# Altium project PCB_Project.PrjPcb
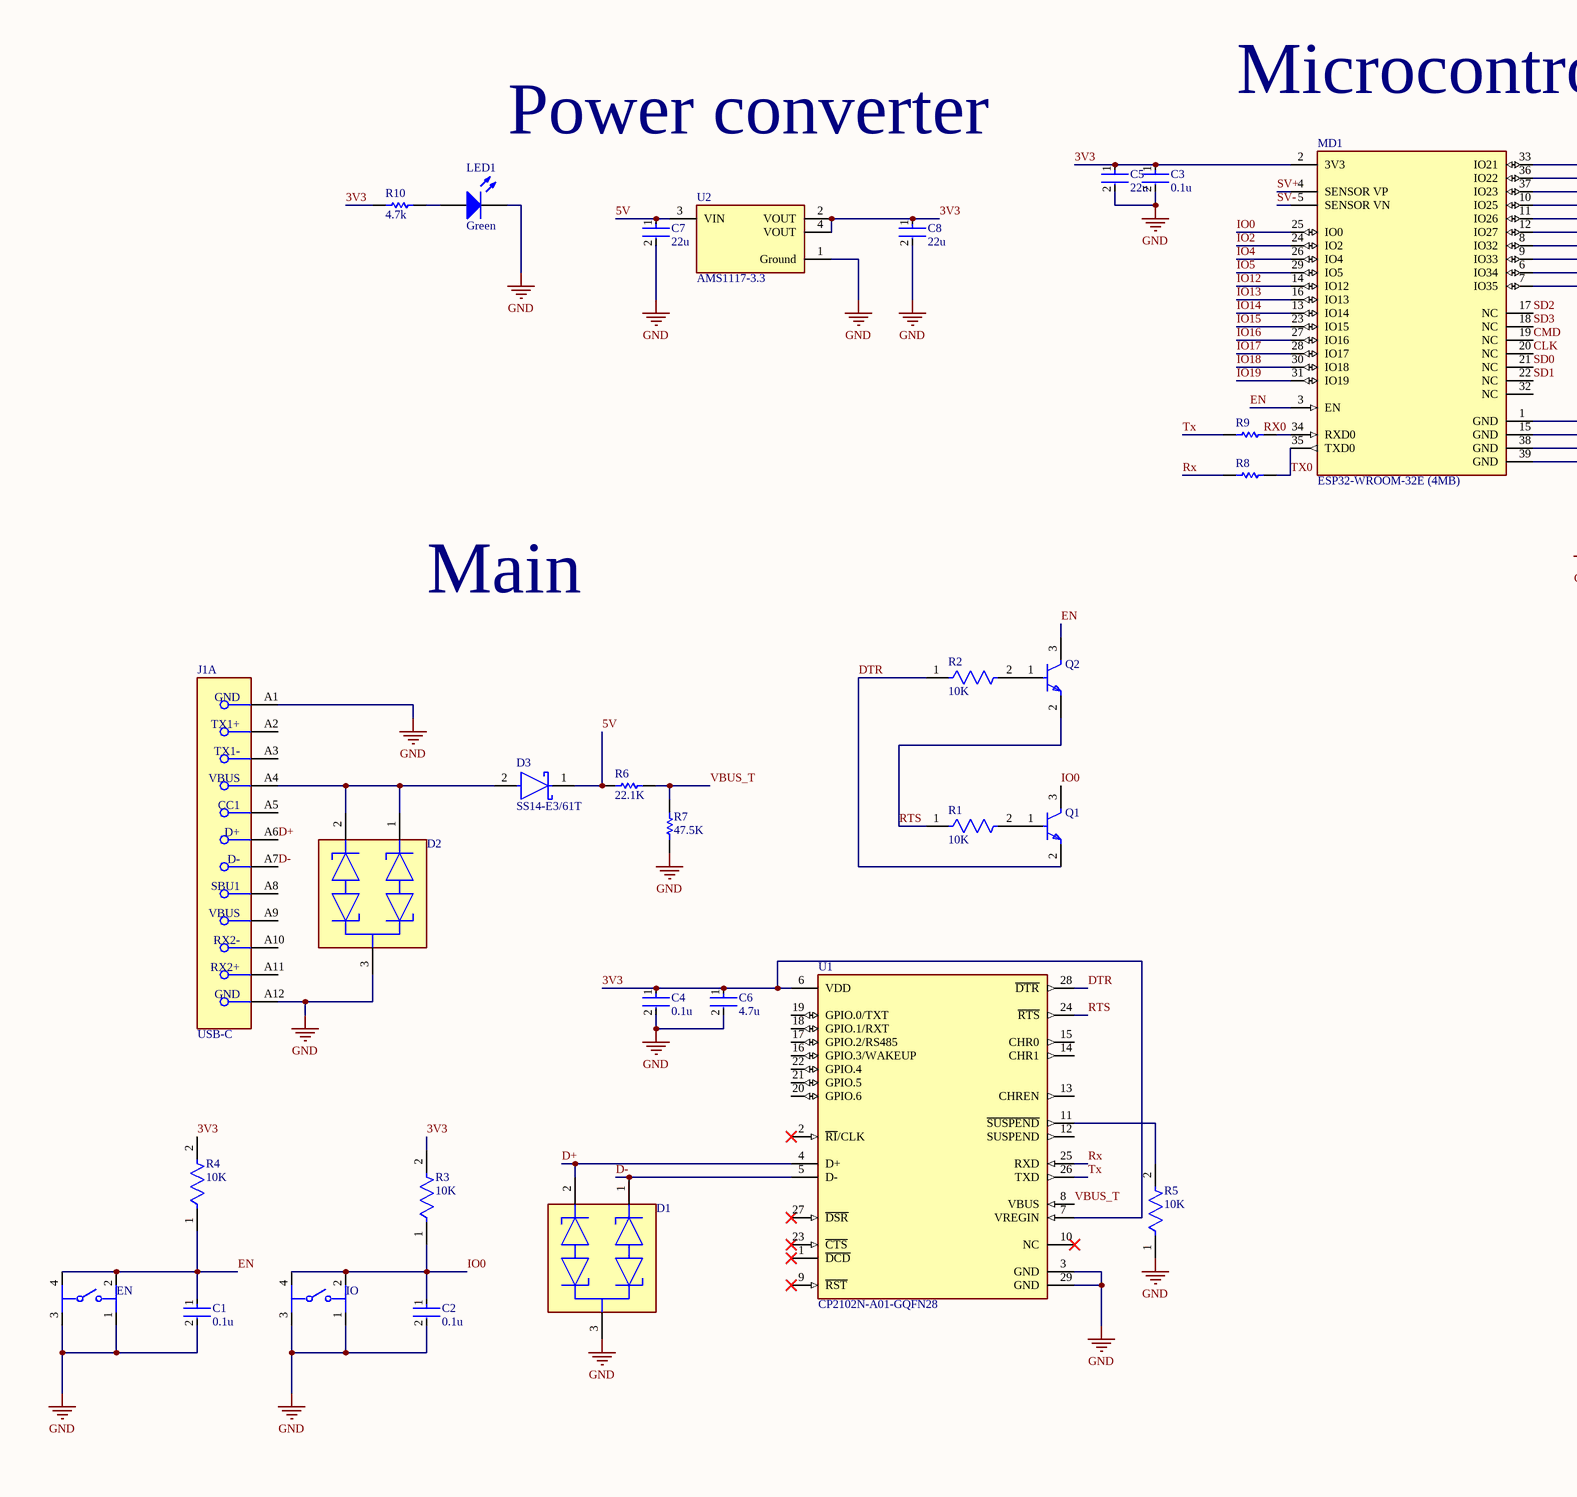
[diagram p0: PCB1.SchDoc, left]
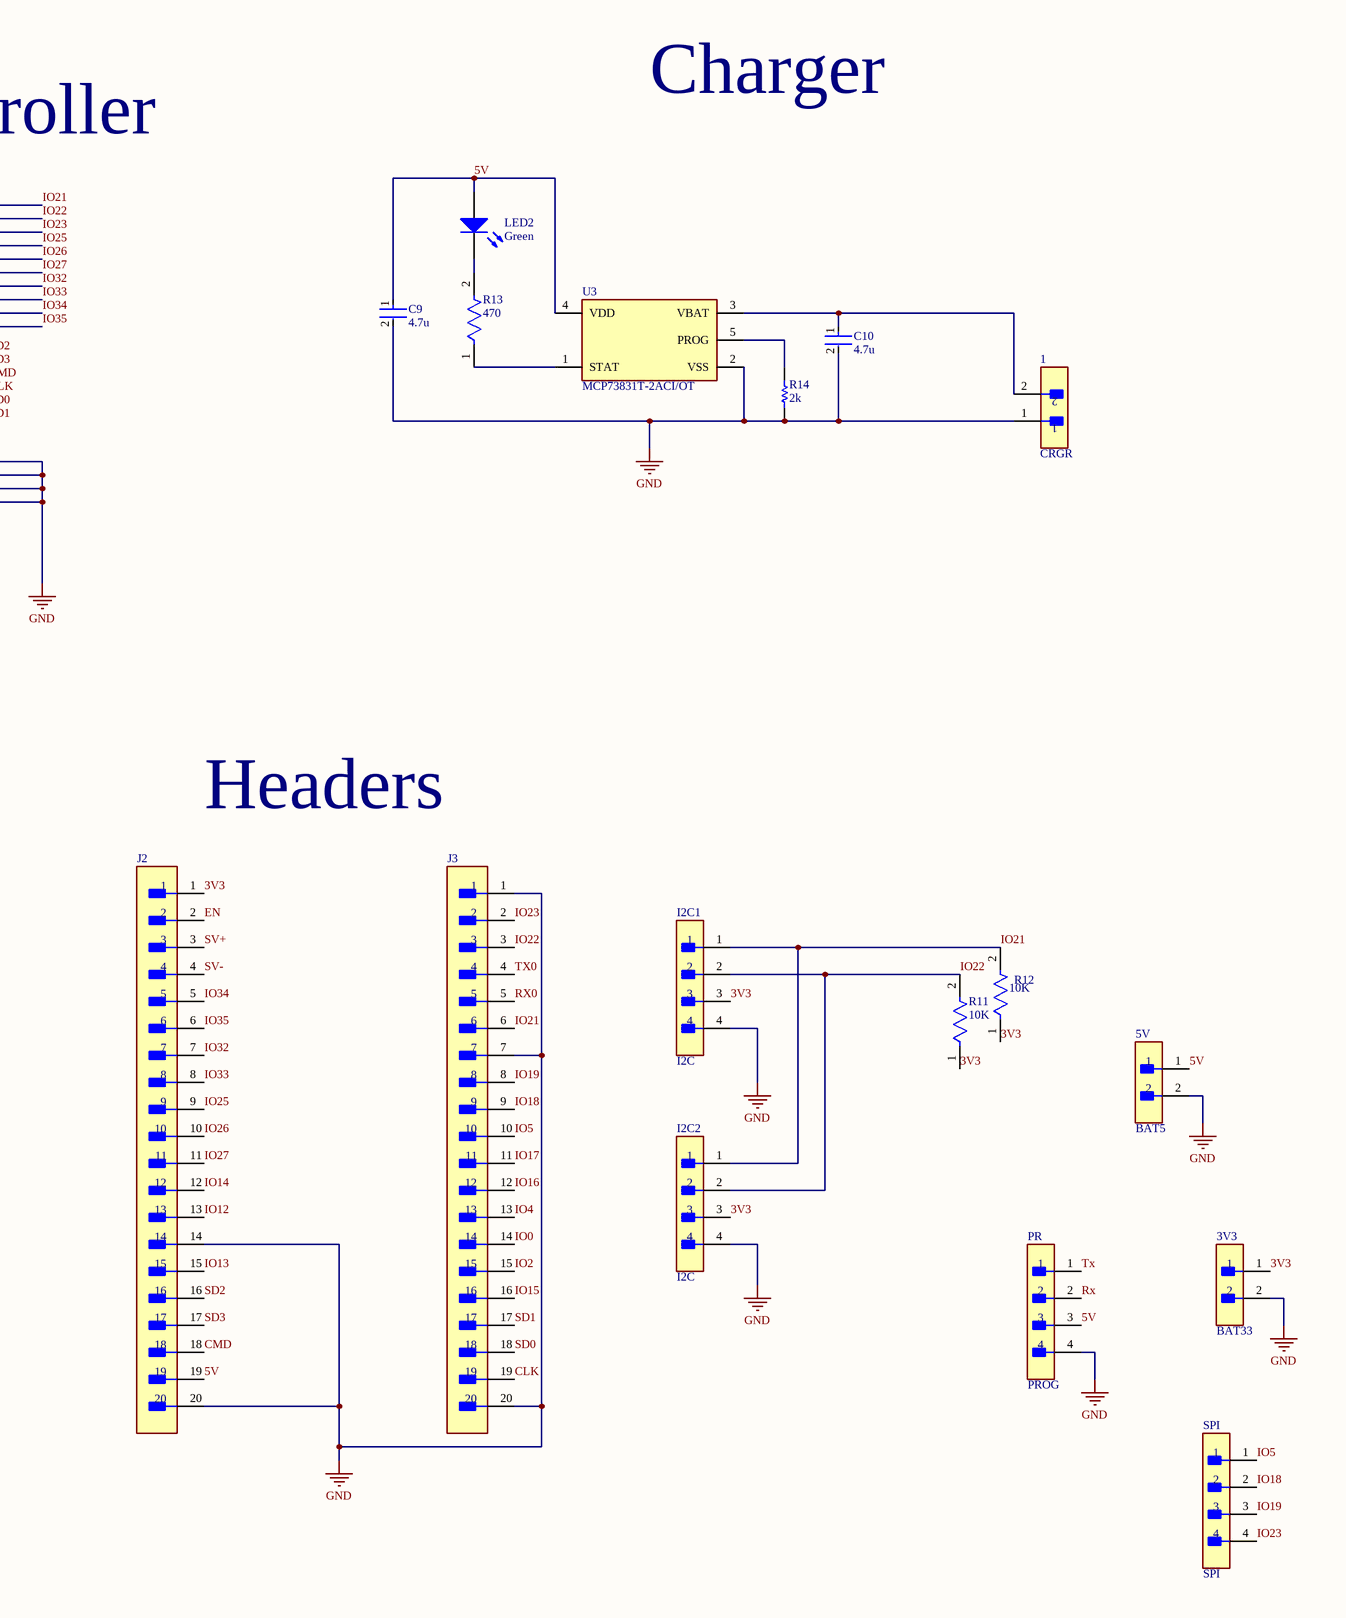
[diagram p1: PCB1.SchDoc, right]
1 sheet, 47 parts. Net scope: global (net labels, ports and power ports of the same name join across sheets).
Board file: PCB1.PcbDoc

## Sheet PCB1.SchDoc
size A2; SheetNumber: 1; SheetTotal: 1

### Parts
1  CRGR  [FP-TSW-102-07-F-S-MFG]
3V3  BAT33  [FP-TSW-102-07-F-S-MFG]
5V  BAT5  [FP-TSW-102-07-F-S-MFG]
C1  0.1u  [FP-CGA5L-0_3-0_1-MFG]
C2  0.1u  [FP-CGA5L-0_3-0_1-MFG]
C3  0.1u  [FP-CGA5L-0_3-0_1-MFG]
C4  0.1u  [FP-CGA5L-0_3-0_1-MFG]
C5  22u  [FP-C3216-160-0_2-IPC_B]
C6  4.7u  [FP-CGA5L-0_3-0_1-IPC_B]
C7  22u  [FP-C3216-160-0_2-IPC_B]
C8  22u  [FP-C3216-160-0_2-IPC_B]
C9  4.7u  [FP-CGA5L-0_3-0_1-IPC_B]
C10  4.7u  [FP-CGA5L-0_3-0_1-IPC_B]
D1  PESD1CAN-UX  [FP-SOT323-MFG]  (value not drawn)
D2  PESD1CAN-UX  [FP-SOT323-MFG]  (value not drawn)
D3  SS14-E3/61T  [FP-95400-MFG]
EN  1301.9315.24  [FP-1301_9315_24-MFG]  (value not drawn)
I2C1  I2C  [FP-MTLW-104-05-G-S-185-MFG]
I2C2  I2C  [FP-MTLW-104-05-G-S-185-MFG]
IO  1301.9315.24  [FP-1301_9315_24-MFG]  (value not drawn)
J1  USB-C  [FP-1054500101-MFG]  (part A of 3)
J2  M52-040023V2045  [FP-M52-040023V2045-MFG]  (value not drawn)
J3  M52-040023V2045  [FP-M52-040023V2045-MFG]  (value not drawn)
LED1  Green  [1206_A]
LED2  Green  [1206_A]
MD1  ESP32-WROOM-32E (4MB)  [FP-ESP32-WROOM-32E_4MB-MFG]
PR  PROG  [FP-MTLW-104-05-G-S-185-MFG]
Q1  SS8050-G  [FP-SS8050-G-MFG]  (value not drawn)
Q2  SS8050-G  [FP-SS8050-G-MFG]  (value not drawn)
R1  10K  [FP-AC1206-MFG]
R2  10K  [FP-AC1206-MFG]
R3  10K  [FP-AC1206-MFG]
R4  10K  [FP-AC1206-MFG]
R5  10K  [FP-AC1206-MFG]
R6  22.1K  [RESC3216X70X50NL05T20]
R7  47.5K  [RESC3116X65X40LL10T20]
R8  ERJ-8GEY0R00V  [RESC3216X70X50NL05T20]  (value not drawn)
R9  ERJ-8GEY0R00V  [RESC3216X70X50NL05T20]  (value not drawn)
R10  4.7k  [RESC3216X70X50NL05T20]
R11  10K  [FP-AC1206-MFG]
R12  10K  [FP-AC1206-MFG]
R13  470  [FP-MCR18-IPC_B]
R14  2k  [RESC3216X60X45LL10T20]
SPI  SPI  [FP-MTLW-104-05-G-S-185-MFG]
U1  CP2102N-A01-GQFN28  [FP-CP2102N-A01-GQFN28-MFG]
U2  AMS1117-3.3  [FP-AMS1117-IPC_C]
U3  MCP73831T-2ACI/OT  [FP-C04-091-OT-IPC_B]

### Nets
GND: 1.1 3V3.2 5V.2 C1.2 C2.2 C3.2 C4.2 C5.2 C6.2 C7.2 C8.2 C9.2 C10.2 D1.3(common_cathode) D2.3(common_cathode) EN.1 EN.3 I2C1.4 I2C2.4 IO.1 IO.3 J1.A1(GND) J1.A12(GND) J2.14 J2.20 J3.1 J3.7 J3.20 LED1.1(K) MD1.1(GND) MD1.15(GND) MD1.38(GND) MD1.39(GND) PR.4 R5.1 R7.1 R14.1 U1.3(GND) U1.29(GND) U2.1(Ground) U3.2(VSS)
3V3: 3V3.1 C3.1 C4.1 C5.1 C6.1 C8.1 I2C1.3 I2C2.3 J2.1 MD1.2(3V3) R3.2 R4.2 R10.1 R11.1 R12.1 U1.6(VDD) U1.7(VREGIN) U2.2(VOUT) U2.4(VOUT)
5V: 5V.1 C7.1 C9.1 D3.1(C) J2.19 LED2.2(A) PR.3 R6.1 U2.3(VIN) U3.4(VDD)
CLK: J3.19 MD1.20(NC)
CMD: J2.18 MD1.19(NC)
D+: D1.2(cathode_2) J1.A6(D+) U1.4(D+)
D-: D1.1(cathode_1) J1.A7(D-) U1.5(D-)
DTR: Q1.2(E) R2.1 U1.28(~{DTR})
EN: C1.1 EN.2 EN.4 J2.2 MD1.3(EN) Q2.3(C) R4.1
IO0: C2.1 IO.2 IO.4 J3.14 MD1.25(IO0) Q1.3(C) R3.1
IO2: J3.15 MD1.24(IO2)
IO4: J3.13 MD1.26(IO4)
IO5: J3.10 MD1.29(IO5) SPI.1
IO12: J2.13 MD1.14(IO12)
IO13: J2.15 MD1.16(IO13)
IO14: J2.12 MD1.13(IO14)
IO15: J3.16 MD1.23(IO15)
IO16: J3.12 MD1.27(IO16)
IO17: J3.11 MD1.28(IO17)
IO18: J3.9 MD1.30(IO18) SPI.2
IO19: J3.8 MD1.31(IO19) SPI.3
IO21: I2C1.1 I2C2.1 J3.6 MD1.33(IO21) R12.2
IO22: I2C1.2 I2C2.2 J3.3 MD1.36(IO22) R11.2
IO23: J3.2 MD1.37(IO23) SPI.4
IO25: J2.9 MD1.10(IO25)
IO26: J2.10 MD1.11(IO26)
IO27: J2.11 MD1.12(IO27)
IO32: J2.7 MD1.8(IO32)
IO33: J2.8 MD1.9(IO33)
IO34: J2.5 MD1.6(IO34)
IO35: J2.6 MD1.7(IO35)
RTS: Q2.2(E) R1.1 U1.24(~{RTS})
Rx: PR.2 R8.1 U1.25(RXD)
RX0: J3.5
SD0: J3.18 MD1.21(NC)
SD1: J3.17 MD1.22(NC)
SD2: J2.16 MD1.17(NC)
SD3: J2.17 MD1.18(NC)
SV+: J2.3 MD1.4(SENSOR_VP)
SV-: J2.4 MD1.5(SENSOR_VN)
Tx: PR.1 R9.1 U1.26(TXD)
TX0: J3.4 MD1.35(TXD0) R8.2
VBUS_T: R6.2 R7.2 U1.8(VBUS)
Net1_2: 1.2 C10.1 U3.3(VBAT)
NetD2_1: D2.1(cathode_1) D2.2(cathode_2) D3.2(A) J1.A4(VBUS)
NetLED1_2: LED1.2(A) R10.2
NetLED2_1: LED2.1(K) R13.2
NetMD1_34: MD1.34(RXD0) R9.2
NetQ1_1: Q1.1(B) R1.2
NetQ2_1: Q2.1(B) R2.2
NetR5_2: R5.2 U1.11(~{SUSPEND})
NetR13_1: R13.1 U3.1(STAT)
NetR14_2: R14.2 U3.5(PROG)

Not connected (* = marked no-connect by the designer): J1 A2(TX1+) A3(TX1-) A5(CC1) A8(SBU1) A9(VBUS) A10(RX2-) A11(RX2+); MD1 32(NC); U1 1(~{DCD})* 2(~{RI}/CLK)* 9(~{RST})* 10(NC)* 12(SUSPEND) 13(CHREN) 14(CHR1) 15(CHR0) 16(GPIO.3/WAKEUP) 17(GPIO.2/RS485) 18(GPIO.1/RXT) 19(GPIO.0/TXT) 20(GPIO.6) 21(GPIO.5) 22(GPIO.4) 23(~{CTS})* 27(~{DSR})*

### Notes on the sheet
- Charger
- Microcontroller
- Power converter
- Main
- Headers
- Labels drawn without touching a wire or pin: RX0

### Library data of the parts
1 3V3 5V = CMP-02766-001458-1: CONN HEADER VERT 2POS 2.54MM; Gender: Male; Max Current Rating: 7.6A; Number of Contacts: 2; Max Voltage Rating (AC): 550V; Orientation: Straight; Depth: 2.54mm; Series: TSW; Package Quantity: 1; Min Operating Temperature: -55°C; Max Operating Temperature: 125°C; Contact Type: Male Pin; Contact Shape: Square; Color: Black; Housing Color: Black; Connector Type: Header; Fastening Type: Pull; Radiation Hardening: No; Pitch: 2.54mm; Housing Material: Polyester; Mount: Through Hole; Number of Positions: 2; Number of Rows: 1; Contact Material: Bronze; Insulation Color: Black; Contact Finish - Mating: GOLD; Termination: Solder; Insulation Material: PBT; Length: 5.08mm; Flammability Rating: UL94 V-0; Contact Mating Length: 0.23inch; REACH SVHC: No SVHC; Contact Plating: Gold; RoHS Compliant: Yes; Packaging: Bulk
C1-C4 = CMP-08246-001942-1: Cap Ceramic 100nF 450V X7T 10% Pad SMD 1206 +125°C Automotive T/R; Dielectric: X7T; Max Operating Temperature: 125°C; Voltage Rating: 450V; Lead Free: Lead Free; Capacitance: 100nF; Packaging: Tape and Reel; Voltage Rating (DC): 450V; Min Operating Temperature: -55°C; Termination: SMD/SMT; Tolerance: 10%; Case/Package: 1206; Case Code (Imperial): 1206; Case Code (Metric): 3216
C5 C7 C8 = CMP-08246-004697-1: Multilayer Ceramic Capacitors 22uF ±20% 25V X5R SMD 1206; RoHS Compliant: Yes; Thickness: 0.071inch; Mount: Surface Mount; Termination: SMD/SMT; Height: 1.6mm; Resistor Type: Ceramic; REACH SVHC: No SVHC; Packaging: Tape and Reel; Construction: Flat; Depth: 1.6mm; Lead Free: Lead Free; Tolerance: 20%; Width: 0.063inch; Capacitance: 22uF; Weight: 0.000571oz; Case Code (Imperial): 1206; Case/Package: 1206; Min Operating Temperature: -55°C; Package Quantity: 1; Voltage Rating (DC): 25V; Length: 3.2mm; Voltage Rating: 25V; Case Code (Metric): 3216; Dielectric: X5R; Series: C; Dielectric Material: Ceramic; Max Operating Temperature: 85°C
C6 C9 C10 = CMP-08246-001672-1: Cap Ceramic 4.7uF 35V X7R 10% Pad SMD 1206 +125°C Automotive T/R; Length: 3.2mm; Tolerance: 10%; Min Operating Temperature: -55°C; Termination: SMD/SMT; Mount: Surface Mount; Weight: 0.000571oz; Voltage Rating (DC): 35V; Width: 1.6mm; Case Code (Imperial): 1206; Capacitance: 4.7uF; Case Code (Metric): 3216; Composition: Ceramic; Thickness: 0.075inch; Ratings: AEC-Q200; Dielectric: X7R; Package Quantity: 1; Voltage Rating: 35V; Height: 1.6mm; Case/Package: 1206; Packaging: Tape and Reel; Max Operating Temperature: 125°C; Depth: 1.6mm
D1 D2 = CMP-14436-000006-1: TVS DIODE 24V 50V SC70-3
D3 = CMP-02539-000035-1: DIODE SCHOTTKY 40V 1A DO214AC; Manufacturer: Vishay; Peak Reverse Current: 0.2mA; Standoff Height: 0mm; Max Junction Temp: +150°C; Max Surge Forward Current: 40A; RoHS: TRUE; Digikey Description: DIODE SCHOTTKY 40V 1A DO214AC; Category: Diode; Device Class L3: Schottky Diodes; Temperature Range High: +150°C; Automotive: No; Temperature: -65°C to +150°C; Device Class L2: Diodes; Forward Current: 1A; Temperature Range Low: -65°C; Footprint Url: http://www.vishay.com/docs/95400/sma.pdf; Octopart: https://octopart.com/ss14-e3%2F61t-vishay-39552847; Package: 95400; Max Repetitive Reverse Voltage: 40V; ComponentLink2Description: Datasheet; ComponentLink2URL: http://www.vishay.com/docs/88746/ss12.pdf; Lead Free: Yes; Height: 2.29mm; Mouser Description: SS14 Series 40 V 1 A Surface Mount Schottky Barrier Rectifier - DO-214AC (SMA); Manufacturer Part Number: SS14-E3/61T; Device Class L1: Discrete Semiconductors
EN IO = CMP-26321-000002-1: SWITCH TACTILE SPST-NO 0.05A 12V; Illumination Type: Illuminated; Mechanical Life: 100000Cycles; Actuator Type: Standard; Throw Configuration: SPST; Current Rating: 50mA; Switch Function: Off-Mom; Operating Force: 1.6N; Ratings: IP40; Switch Travel: 0.25mm; Max Voltage Rating (DC): 12V; Length: 6mm; REACH SVHC: No SVHC; Contact Plating: Silver; Package Quantity: 1000; Radiation Hardening: No; Packaging: Tape and Reel; RoHS Compliant: Yes; Orientation: Straight; Mount: Surface Mount; Depth: 10mm; Voltage Rating (AC): 12V; Termination: Gull Wing; Max Operating Temperature: 70°C; Case/Package: SMD/SMT; Voltage Rating (DC): 12V; Min Operating Temperature: -20°C; Series: LSH; Max Current Rating: 50mA
I2C1 I2C2 PR SPI = CMP-02766-000562-1: CONN HEADER VERT 4POS 2.54MM; Number of Contacts: 4; Contact Resistance: 15mR; Connector Type: Male Pin; Gender: Male; Contact Material: Brass; Height: 6.4mm; Contact Mating Length: 0.185inch; Length: 29.64mm; Number of Positions: 4; Packaging: Rail/Tube; Mount: Through Hole; Depth: 2.48mm; Number of Rows: 1; Radiation Hardening: No; Housing Material: Polymer; Pitch: 2.54mm; Max Operating Temperature: 105°C; Termination: Solder; Min Operating Temperature: -40°C; Color: Black; Orientation: Straight; Housing Color: Black; Contact Plating: Gold
J1 = CMP-04767-000004-1: CONN RCP USB3.1 TYPEC 24P SMD RA; Manufacturer: Molex; Manufacturer Part Number: 1054500101; Number Of Contacts: 24; Voltage Rating: 30V; Shielding: true; Is Female: yes; Current Rating: 0.25/1.25/5A; Pitch: 0.5mm; Conn Orientation: Right Angle; Package: 0; Height: 3.44mm; Footprint Url: https://www.molex.com/pdm_docs/sd/1054500101_sd.pdf; Device Class L1: Connectors; Category: Conn; Device Class L2: USB Connectors; Digikey Description: CONN RCP USB3.1 TYPEC 24P SMD RA; Contact Material: Gold,Nickel; Mouser Description: USB Shielded I/O Receptacle; Type C; Right Angle; Surface Mount; Gold over Nickel; ComponentLink2Description: Datasheet; Lead Free: Yes; Automotive: No; Temperature Range High: +85°C; RoHS: TRUE; Octopart: https://octopart.com/105450-0101-molex-68082325; ComponentLink2URL: https://www.molex.com/webdocs/datasheets/pdf/en-us/1054500101_IO_CONNECTORS.pdf; Temperature: -30°C to +85°C; Usb Standard: USB 3.1; Temperature Range Low: -30°C; Device Class L3: unset
J2 J3 = CMP-15831-000096-1: CONN HEADER VERT 20POS 1.27MM; Voltage Rating: 500V; Contact Resistance: 30mR; Number of Contacts: 20; Insulation Resistance: 1GR; Mated Stacking Heights: 11mm; Max Current Rating: 1A; Gender: Male; Depth: 2.5mm; Pitch: 1.27mm; Contact Gender: Male; Insulation Material: Nylon; Length: 25.4mm; Contact Type: Male Pin; Min Operating Temperature: -40°C; Mount: Through Hole; Max Operating Temperature: 105°C; Connector Type: Header; Termination: Solder; Number of Rows: 1; Package Quantity: 300; Contact Material: Brass; Orientation: Straight; Flammability Rating: UL94 V-0; Series: M52; Current Rating: 1A; Housing Color: Black; Housing Material: Nylon; Insulation Color: Black; Case/Package: SIL; Number of Positions: 20; Reach SVHC Compliant: Yes; Packaging: Bulk; Contact Finish - Mating: GOLD; Fastening Type: Pull; Contact Plating: Gold; Contact Shape: Square
LED1 LED2 = CMP-1426-00016-1: SMD mono-color Chip LED, WL-SMCW, Bright Green; PartNumber: 150120VS75000; Manufacturer: Wuerth Elektronik; ComponentLink2URL: http://katalog.we-online.com/led/datasheet/150120VS75000.pdf; Color: Bright Green; ComponentLink2Description: Datasheet; ComponentLink1URL: http://www.we-online.com; PackageReference: 1206_A; ComponentLink1Description: Manufacturer URL
MD1 = CMP-194065-000026-1: RX TXRX MOD WIFI TRACE ANT SMD
Q1 Q2 = CMP-20235-000001-1: NPN TRANSISTOR 1.5A 40V SOT-23 R; Transition Frequency: 100MHz; Max Breakdown Voltage: 25V; Collector Emitter Voltage (VCEO): 400mV; Max Power Dissipation: 300mW; Max Collector Current: 1.5A; Case/Package: TO-236-3; Packaging: Tape and Reel; RoHS Compliant: Yes; Mount: Surface Mount; Collector Emitter Breakdown Voltage: 25V
R1-R5 R11 R12 = CMP-2003-04902-2: RES SMD 10K OHM 5% 1/4W 1206; Manufacturer Part Number: AC1206JR-0710KL; Manufacturer: Yageo; Power Rating: 0.25W; Resistance: 10KΩ; Value: 10KΩ; Tolerance: 0.05; Automotive Grade: Grade 0; Voltage Rating: 200V; Height: 0.65mm; Device Class L2: Resistors; Series: AC; Footprint Url: http://www.yageo.com/exep/pages/download/literatures/PYu-R_Mount_10.pdf; Automotive: Yes; ComponentLink2URL: http://www.yageo.com/NewPortal/yageodocoutput?fileName=/pdf/R-Chip/PYu-AC_51_RoHS_L_6.pdf; Digikey Description: RES SMD 10K OHM 5% 1/4W 1206; Octopart: https://octopart.com/ac1206jr-0710kl-yageo-30511262; Package: AC1206; Lead Free: Yes; Temperature Range High: +155°C; ComponentLink2Description: Datasheet; Device Class L1: Passive Components; Ipc Land Pattern Name: RESC310160X55; Device Class L3: Chip SMD Resistors; RoHS: TRUE; Temperature Range Low: -55°C; Composition: Thick Film; Temperature: -55°C to +155°C; Mouser Description: Res Thick Film 1206 10K Ohm 5% 0.25W(1/4W) ±100ppm/C Epoxy Pad SMD Automotive T/R; Category: Res
R6 = CMP-2003-00221-1: Part Number: ERJ-8ENF2212V; Manufacturer: Panasonic
R7 = CMP-2003-03778-1: Manufacturer: Yageo; Part Number: RC1206FR-0747K5L
R8 R9 = CMP-2003-00541-1: Manufacturer: Panasonic; Part Number: ERJ-8GEY0R00V
R10 = CMP-2003-00742-1: Part Number: ERJ8BQF4R7V; Manufacturer: Panasonic
R13 = CMP-08839-020936-1: Thick Film Chip Resistor, 1206, 470Ω, 5%, 200ppm/°C, 0.25W, 200V; Max Power Dissipation: 250mW; Resistance: 470R; Height: 0.026inch; Width: 0.061inch; RoHS Compliant: Yes; Tolerance: 5%; Number of Terminations: 2; Package Quantity: 5000; Case Code (Imperial): 1206; Temperature Coefficient: 200ppm/°C; Max Operating Temperature: 155°C; Length: 0.12inch; Voltage Rating (DC): 200V; Case Code (Metric): 3216; Min Operating Temperature: -55°C; Packaging: Tape and Reel; Resistor Type: Thick Film; Lead Free: Lead Free; Case/Package: 1206
R14 = CMP-2003-02029-1: Manufacturer: Vishay Dale; Part Number: CRCW12062K00FKTA
U1 = CMP-08093-000004-1: IC BRIDGE USB TO UART 28QFN; Manufacturer: Silicon Labs; Standoff Height: 0mm; Max Junction Temp: +105°C; Usb Standard: USB 2.0; Number Of Ports: 1; Nominal Supply Current: 195-13700uA; Min Supply Voltage: 1.71V; Max Supply Voltage: 5.25V; Interface: UART,USB,RS-232,RS-485; Height: 0.8mm; Package: CP2102N-A01-GQFN28; Temperature Range Low: -40°C; Lead Free: Yes; Category: IC; Ambient Temperature Range High: +85°C; Device Class L3: USB Interface ICs; Octopart: https://octopart.com/cp2102n-a01-gqfn28-silicon+labs-74636024; Manufacturer Part Number: CP2102N-A01-GQFN28; Device Class L2: Interface ICs; ComponentLink2URL: https://media.digikey.com/pdf/Data%20Sheets/Silicon%20Laboratories%20PDFs/CP2102N_Rev.1.3_DS.pdf; Automotive: No; Temperature: -40°C to +85°C; Device Class L1: Integrated Circuits (ICs); Mouser Description: IC BRIDGE USB TO UART 28QFN; RoHS: TRUE; Ambient Temperature Range Low: -40°C; Temperature Range High: +85°C; Ipc Land Pattern Name: QFN50P500X500X75-28; Digikey Description: IC BRIDGE USB TO UART 28QFN; ComponentLink2Description: Datasheet
U2 = CMP-209535-000001-1: LDO Voltage Regulators 1A, 3.3V; Manufacturer: Advanced Monolithic Systems; Dropout Voltage: 1.1V; Output Type: Fixed; Nominal Supply Current: 5mA; Max Power Dissipation: 1.2W; Max Supply Voltage: 15V; Number Of Outputs: 1; Standoff Height: 0.64mm; Max Junction Temp: +125°C; Height: 1.8mm; Package: AMS1117; Device Class L2: Power Management ICs; ComponentLink2Description: Datasheet; ComponentLink2URL: http://www.advanced-monolithic.com/pdf/ds1117.pdf; Category: IC; RoHS: TRUE; Automotive: No; Device Class L1: Integrated Circuits (ICs); Output Current: 1A; Device Class L3: Voltage Regulators - Linear; Temperature: -40°C to +125°C; Output Voltage: 3.3V; Manufacturer Part Number: AMS1117-3.3; Temperature Range Low: -40°C; Octopart: https://octopart.com/ams1117-3.3-advanced+monolithic+systems-25899300; Lead Free: Yes; Ipc Land Pattern Name: SOT229P700X180-4; Temperature Range High: +125°C
U3 = CMP-0133-00143-2: IC CONTROLLR LI-ION 4.2V SOT23-5; Max Power Dissipation: 1.54W; Output Current: 500mA; Max Output Voltage: 4.5V; Number of Outputs: 1; Min Output Voltage: 4.168V; Min Supply Voltage: 3.75V; Max Input Voltage: 6V; Voltage Rating: 4.534V; Drain to Source Resistance: 350mR; Max Operating Temperature: 85°C; Length: 0.122inch; Number of Pins: 5; REACH SVHC: No SVHC; Radiation Hardening: No; Min Operating Temperature: -40°C; Weight: 0.00709oz; Contact Plating: Tin; Termination: SMD/SMT; Case/Package: SOT-23; Mount: Surface Mount; Width: 0.071inch; Packaging: Tape and Reel; Number of Cells: 1; Max Charge Current: 500mA; Height: 0.051inch; Number of Channels: 1; Output Voltage: 4.2V; Max Supply Voltage: 6V; Lead Free: Lead Free